# Altium project STX165R_UAVCAN_module.PrjPcb
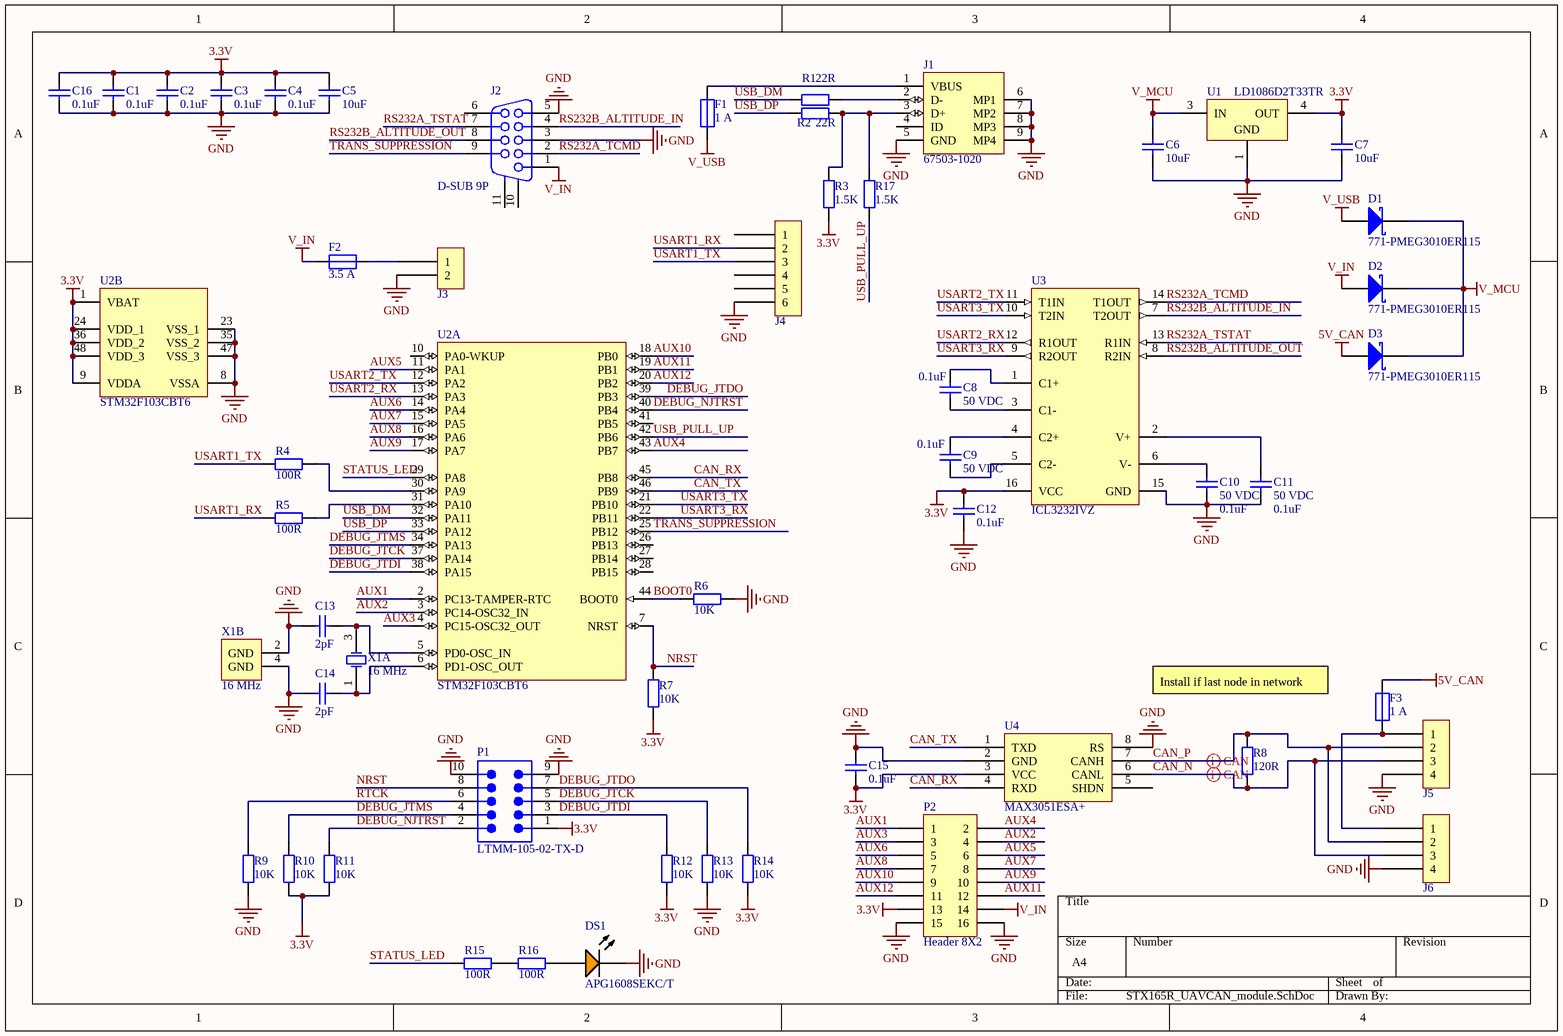
[diagram p0: STX165R_UAVCAN_module.SchDoc]
1 sheet, 53 parts. Net scope: global (net labels, ports and power ports of the same name join across sheets).
Board file: PCB_main.PcbDoc

## Sheet STX165R_UAVCAN_module.SchDoc
size A4

### Parts
C1  value 0.1uF  [0603C_L]  (hidden comment: VJ0603Y104JXJPW1BC)
C2  value 0.1uF  [0603C_L]  (hidden comment: VJ0603Y104JXJPW1BC)
C3  value 0.1uF  [0603C_L]  (hidden comment: VJ0603Y104JXJPW1BC)
C4  value 0.1uF  [0603C_L]  (hidden comment: VJ0603Y104JXJPW1BC)
C5  value 10uF  [1206_1.6_L]  (hidden comment: TMK316B7106KL-TD)
C6  value 10uF  [1206_1.6_L]  (hidden comment: GRM31CR61H106MA12L)
C7  value 10uF  [1206_1.6_L]  (hidden comment: TMK316B7106KL-TD)
C8  value 0.1uF  Voltage Rating DC: 50 VDC  [0603C_L]  (hidden comment: GRM188R71H104KA93D)
C9  value 0.1uF  Voltage Rating DC: 50 VDC  [0603C_L]  (hidden comment: GRM188R71H104KA93D)
C10  value 0.1uF  Voltage Rating DC: 50 VDC  [0603C_L]  (hidden comment: GRM188R71H104KA93D)
C11  value 0.1uF  Voltage Rating DC: 50 VDC  [0603C_L]  (hidden comment: GRM188R71H104KA93D)
C12  value 0.1uF  [0603C_L]  (hidden comment: VJ0603Y104JXJPW1BC)
C13  value 2pF  [0603C_L]  (hidden comment: C1608C0G1H020C080AA)
C14  value 2pF  [0603C_L]  (hidden comment: C1608C0G1H020C080AA)
C15  value 0.1uF  [0603C_L]  (hidden comment: VJ0603Y104JXJPW1BC)
C16  value 0.1uF  [0603C_L]  (hidden comment: VJ0603Y104JXJPW1BC)
D1  Supplier Part Number 1: 771-PMEG3010ER115  [SOD123W_L]  (hidden comment: PMEG3010ER,115)
D2  Supplier Part Number 1: 771-PMEG3010ER115  [SOD123W_L]  (hidden comment: PMEG3010ER,115)
D3  Supplier Part Number 1: 771-PMEG3010ER115  [SOD123W_L]  (hidden comment: PMEG3010ER,115)
DS1  APG1608SEKC/T  [KING-LED0603-25-ORANGE_V]
F1  Current Rating: 1 A  [0603R_0.45_L]  (hidden comment: F0603E1R00FSTR)
F2  Current Rating: 3.5 A  [0603R_0.45_L]  (hidden comment: 0603SFV350F/32-2)
F3  Current Rating: 1 A  [0603R_0.45_L]  (hidden comment: F0603E1R00FSTR)
J1  67503-1020  [MOLX-67503-1020_V]
J2  D-SUB 9P  [1-1634222-2]
J3  43650-0224  [43650-0224]  (value not drawn)
J4  BM06B-GHS-TBT(LF)(SN)(N)  [BM06B-GHS-TBT]  (value not drawn)
J5  BM04B-GHS-TBT(LF)(SN)(N)  [BM04B-GHS-TBT]  (value not drawn)
J6  BM04B-GHS-TBT(LF)(SN)(N)  [BM04B-GHS-TBT]  (value not drawn)
P1  LTMM-105-02-TX-D  [SMTC-LTMM-105-02-XX-D]
P2  Header 8X2  [HDR2X8]
R1  value 22R  [0603R_0.45_L]  (hidden comment: CRCW060322R0JNEB)
R2  value 22R  [0603R_0.45_L]  (hidden comment: CRCW060322R0JNEB)
R3  value 1.5K  [0603R_0.45_L]  (hidden comment: CRCW06031K50JNEB)
R4  value 100R  [0603R_0.45_L]  (hidden comment: CRCW0603100RJNEB)
R5  value 100R  [0603R_0.45_L]  (hidden comment: CRCW0603100RJNEB)
R6  value 10K  [0603R_0.45_L]  (hidden comment: CRCW060310K0JNEB)
R7  value 10K  [0603R_0.45_L]  (hidden comment: CRCW060310K0JNEB)
R8  value 120R  [0603R_0.45_L]  (hidden comment: CRCW0603120RJNEB)
R9  value 10K  [0603R_0.45_L]  (hidden comment: CRCW060310K0JNEB)
R10  value 10K  [0603R_0.45_L]  (hidden comment: CRCW060310K0JNEB)
R11  value 10K  [0603R_0.45_L]  (hidden comment: CRCW060310K0JNEB)
R12  value 10K  [0603R_0.45_L]  (hidden comment: CRCW060310K0JNEB)
R13  value 10K  [0603R_0.45_L]  (hidden comment: CRCW060310K0JNEB)
R14  value 10K  [0603R_0.45_L]  (hidden comment: CRCW060310K0JNEB)
R15  value 100R  [0603R_0.45_L]  (hidden comment: CRCW0603100RJNEB)
R16  value 100R  [0603R_0.45_L]  (hidden comment: CRCW0603100RJNEB)
R17  value 1.5K  [0603R_0.45_L]  (hidden comment: CRCW06031K50JNEB)
U1  LD1086D2T33TR  [TO-263_N]
U2  STM32F103CBT6  [STM-LQFP48_L]  (parts A,B of 2)
U3  ICL3232IVZ  [TSSOP16_L]
U4  MAX3051ESA+  [SOIC8_L]
X1  Frequency: 16 MHz  [TSX-3225 16.0000MF09Z-AC3]  (hidden comment: CRYS 16MHz 9pF)  (parts A,B of 2)

### Nets
3.3V: C1.2 C2.2 C3.2 C4.2 C5.2 C7.2 C12.2 C15.1 C16.2 P1.1 P2.13 R3.1 R7.1 R10.1 R11.1 R12.1 R14.1 U1.4(OUT) U2.1(VBAT) U2.9(VDDA) U2.24(VDD_1) U2.36(VDD_2) U2.48(VDD_3) U3.16(VCC) U4.3(VCC)
5V_CAN: D3.2(A) F3.2
GND: C1.1 C2.1 C3.1 C4.1 C5.1 C6.1 C7.1 C10.1 C11.1 C12.1 C13.1 C14.1 C15.2 C16.1 DS1.2(K) J1.5(GND) J1.6(MP1) J1.7(MP2) J1.8(MP3) J1.9(MP4) J2.3 J2.5 J3.2 J4.6 J5.4 J6.4 P1.9 P1.10 P2.15 P2.16 R6.1 R9.1 R13.1 U1.1(GND) U2.8(VSSA) U2.23(VSS_1) U2.35(VSS_2) U2.47(VSS_3) U3.15(GND) U4.2(GND) U4.8(RS) X1.2(GND) X1.4(GND)
V_IN: D2.2(A) F2.1 J2.1 P2.14
V_MCU: C6.2 D1.1(K) D2.1(K) D3.1(K) U1.3(IN)
V_USB: D1.2(A) F1.1
AUX1: P2.1 U2.2(PC13-TAMPER-RTC)
AUX2: P2.4 U2.3(PC14-OSC32_IN)
AUX3: P2.3 U2.4(PC15-OSC32_OUT)
AUX4: P2.2 U2.43(PB7)
AUX5: P2.6 U2.11(PA1)
AUX6: P2.5 U2.14(PA4)
AUX7: P2.8 U2.15(PA5)
AUX8: P2.7 U2.16(PA6)
AUX9: P2.10 U2.17(PA7)
AUX10: P2.9 U2.18(PB0)
AUX11: P2.12 U2.19(PB1)
AUX12: P2.11 U2.20(PB2)
BOOT0: R6.2 U2.44(BOOT0)
CAN_N: J5.3 J6.3 R8.1 U4.6(CANL)
CAN_P: J5.2 J6.2 R8.2 U4.7(CANH)
CAN_RX: U2.45(PB8) U4.4(RXD)
CAN_TX: U2.46(PB9) U4.1(TXD)
DEBUG_JTCK: P1.5 R13.2 U2.37(PA14)
DEBUG_JTDI: P1.3 R12.2 U2.38(PA15)
DEBUG_JTDO: P1.7 R14.2 U2.39(PB3)
DEBUG_JTMS: P1.4 R10.2 U2.34(PA13)
DEBUG_NJTRST: P1.2 R11.2 U2.40(PB4)
NRST: P1.8 R7.2 U2.7(NRST)
RS232A_TCMD: J2.2 U3.14(T1OUT)
RS232A_TSTAT: J2.7 U3.13(R1IN)
RS232B_ALTITUDE_IN: J2.4 U3.7(T2OUT)
RS232B_ALTITUDE_OUT: J2.8 U3.8(R2IN)
RTCK: P1.6 R9.2
STATUS_LED: R15.2 U2.29(PA8)
TRANS_SUPPRESSION: J2.9 U2.25(PB12)
USART1_RX: J4.2 R5.1
USART1_TX: J4.3 R4.1
USART2_RX: U2.13(PA3) U3.12(R1OUT)
USART2_TX: U2.12(PA2) U3.11(T1IN)
USART3_RX: U2.22(PB11) U3.9(R2OUT)
USART3_TX: U2.21(PB10) U3.10(T2IN)
USB_DM: R1.1 U2.32(PA11)
USB_DP: R2.1 U2.33(PA12)
USB_PULL_UP: R17.1 U2.42(PB6)
NetC8_1: C8.1 U3.3(C1-)
NetC8_2: C8.2 U3.1(C1+)
NetC9_1: C9.1 U3.5(C2-)
NetC9_2: C9.2 U3.4(C2+)
NetC10_2: C10.2 U3.6(V-)
NetC11_2: C11.2 U3.2(V+)
NetC13_2: C13.2 U2.5(PD0-OSC_IN) X1.3(X2)
NetC14_2: C14.2 U2.6(PD1-OSC_OUT) X1.1(X1)
NetDS1_1: DS1.1(A) R16.2
NetF1_2: F1.2 J1.1(VBUS)
NetF2_2: F2.2 J3.1
NetF3_1: F3.1 J5.1 J6.1
NetJ1_2: J1.2(D-) R1.2
NetJ1_3: J1.3(D+) R2.2 R3.2 R17.2
NetR4_2: R4.2 U2.30(PA9)
NetR5_2: R5.2 U2.31(PA10)
NetR15_1: R15.1 R16.1

Not connected (* = marked no-connect by the designer): J1 4(ID); J2 6 10(MH2) 11(MH1); J4 1 4 5; U2 10(PA0-WKUP) 26(PB13) 27(PB14) 28(PB15) 41(PB5); U4 5(SHDN)

### Layout directives
differential pair: CAN_N, CAN_P

### Notes on the sheet
- Install if last node in network

### Library data of the parts
C1-C4 C12 C15 C16 = VJ0603Y104JXJPW1BC: CAP CER 0603 0.1uF 16V X7R 5%; Manufacturer: Vishay / Vitramon; Type: Ultra Small Commodity MLCCs; Voltage Rating DC: 16 VDC; Supplier 1: Mouser; Manufacturer Part Number: VJ0603Y104JXJPW1BC; RoHS: RoHS Compliant; Category: Multilayer Ceramic Capacitors MLCC - SMD/SMT; Stock 1: 30210; Pricing 1: 1=0.091, 50=0.022, 100=0.017, 500=0.015, 1000=0.014, 15000=0.011, 75000=0.010 (EUR); Height: 0.95 mm; Length: 1.6 mm; Package/Case: 0603 (1608 metric); Packaging: Reel; Product: General Type MLCCs; Series: VJ W1BC; Termination Style: SMD/SMT; Tolerance: 5 %; Voltage Rating AC: -; Width: 0.8 mm; Brand: Vishay / Vitramon; Case Code - in: 0603; Case Code - mm: 1608; Dielectric: X7R; Maximum Operating Temperature: + 125 C; Minimum Operating Temperature: - 55 C; Standard Pack Qty: 15000; RoHS - Mouser: Y; Minimum Order Quantity: 1; Reeling: True; ComponentLink1URL: http://www.mouser.com/ds/2/427/vjw1bcbascomseries-223529.pdf; ComponentLink1Description: http://www.mouser.com/ds/2/427/vjw1bcbascomseries-223529.pdf; Supplier Part Number 1: 77-VJ0603Y104JXJPBC; Capacitance: 0.1 uF
C5 C7 = TMK316B7106KL-TD: CAP CER 1206 10uF 25V X7R 10%; Manufacturer: Taiyo Yuden; Type: Multilayer Ceramic Capacitor; Voltage Rating DC: 25 VDC; Qualification: AEC-Q200; Supplier 1: Mouser; Supplier Part Number 1: 963-TMK316B7106KL-TD; Manufacturer Part Number: TMK316B7106KL-TD; RoHS: RoHS Compliant; Category: Multilayer Ceramic Capacitors MLCC - SMD/SMT; Stock 1: 113143; Pricing 1: 1=0.434, 10=0.230, 100=0.135, 500=0.105, 1000=0.082, 2000=0.063, 4000=0.059, 10000=0.055, 24000=0.052 (EUR); Capacitance: 10 uF; Height: 1.6 mm; Length: 3.2 mm; Package/Case: 1206 (3216 metric); Packaging: Reel; Product: General Type MLCCs; Series: M; Termination Style: SMD/SMT; Tolerance: 10 %; Width: 1.6 mm; Brand: Taiyo Yuden; Case Code - in: 1206; Case Code - mm: 3216; Dielectric: X7R; Maximum Operating Temperature: + 125 C; Minimum Operating Temperature: - 55 C; Standard Pack Qty: 2000; RoHS - Mouser: Y; Minimum Order Quantity: 1; Reeling: True; ComponentLink1URL: http://www.mouser.com/ds/2/396/mlcc_all_e-541559.pdf; ComponentLink1Description: http://www.mouser.com/ds/2/396/mlcc_all_e-541559.pdf
C6 = GRM31CR61H106MA12L: CAP CER 1206 10uF 50V X5R 20%; Manufacturer: Murata Electronics; Type: General Purpose Ceramic Capacitors; Voltage Rating DC: 50 VDC; Class: Class 2; Product Status: New Product; Supplier 1: Mouser; Supplier Part Number 1: 81-GRM31CR61H106MA2L; Manufacturer Part Number: GRM31CR61H106MA12L; RoHS: RoHS Compliant; Category: Multilayer Ceramic Capacitors MLCC - SMD/SMT; Stock 1: 0; Pricing 1: 1=0.308, 10=0.168, 100=0.110, 500=0.100, 1000=0.091, 2000=0.063, 10000=0.062, 24000=0.060, 50000=0.053 (EUR); Capacitance: 10 uF; Height: 1.6 mm; Length: 3.2 mm; Package/Case: 1206 (3216 metric); Packaging: Reel; Product: General Type MLCCs; Series: GRM; Termination Style: SMD/SMT; Tolerance: 20 %; Width: 1.6 mm; Brand: Murata Electronics; Case Code - in: 1206; Case Code - mm: 3216; Dielectric: X5R; Maximum Operating Temperature: + 85 C; Minimum Operating Temperature: - 55 C; Standard Pack Qty: 2000; RoHS - Mouser: Y; Minimum Order Quantity: 1; Reeling: True; ComponentLink1URL: http://www.mouser.com/ds/2/281/c02e-2905.pdf; ComponentLink1Description: http://www.mouser.com/ds/2/281/c02e-2905.pdf
C8-C11 = GRM188R71H104KA93D: CAP CER 0603 0.1uF 50V X7R 10%; Manufacturer: Murata Electronics; Type: General Purpose MLCC; Qualification: Commercial; Supplier 1: Mouser; Supplier Part Number 1: 81-GRM39X104K50D; Manufacturer Part Number: GRM188R71H104KA93D; RoHS: RoHS Compliant; Category: Multilayer Ceramic Capacitors MLCC - SMD/SMT; Stock 1: 1630978; Pricing 1: 1=0.091, 10=0.019, 100=0.013, 500=0.011, 1000=0.008, 4000=0.008 (EUR); Capacitance: 0.1 uF; Height: 0.8 mm; Length: 1.6 mm; Package/Case: 0603 (1608 metric); Packaging: Reel; Product: General Type MLCCs; Series: GRM; Termination Style: SMD/SMT; Tolerance: 10 %; Width: 0.8 mm; Brand: Murata Electronics; Case Code - in: 0603; Case Code - mm: 1608; Dielectric: X7R; Maximum Operating Temperature: + 125 C; Minimum Operating Temperature: - 55 C; Standard Pack Qty: 4000; RoHS - Mouser: Y; Minimum Order Quantity: 1; Reeling: True; ComponentLink1URL: http://www.mouser.com/ds/2/281/c02e-2905.pdf; ComponentLink1Description: http://www.mouser.com/ds/2/281/c02e-2905.pdf
C13 C14 = C1608C0G1H020C080AA: CAP CER 2pF 0603 50V C0G 12.5%; Manufacturer: TDK; Tolerance: 0.25 pF; Type: Commercial Grade MLCC; Voltage Rating DC: 50 VDC; Class: Class 1; Dielectric: C0G (NP0); Supplier 1: Mouser; Supplier Part Number 1: 810-C1608C0G1H020C; Manufacturer Part Number: C1608C0G1H020C080AA; RoHS: RoHS Compliant; Category: Multilayer Ceramic Capacitors MLCC - SMD/SMT; Stock 1: 11697; Pricing 1: 1=0.262, 10=0.033, 100=0.023, 500=0.020, 1000=0.015, 4000=0.013, 8000=0.011, 24000=0.010, 48000=0.008 (EUR); Capacitance: 2 pF; Height: 0.8 mm; Length: 1.6 mm; Package/Case: 0603 (1608 metric); Packaging: Reel; Product: General Type MLCCs; Series: C; Termination Style: SMD/SMT; Width: 0.8 mm; Brand: TDK; Case Code - in: 0603; Case Code - mm: 1608; Maximum Operating Temperature: + 125 C; Minimum Operating Temperature: - 55 C; Standard Pack Qty: 4000; Termination: -; RoHS - Mouser: Y; Minimum Order Quantity: 1; Reeling: True; ComponentLink1URL: http://www.mouser.com/ds/2/400/lcc_commercial_general_en-837201.pdf; ComponentLink1Description: http://www.mouser.com/ds/2/400/lcc_commercial_general_en-837201.pdf
D1-D3 = PMEG3010ER,115: Schottky Diodes & Rectifiers SCHOTTKY DIODE; Manufacturer: NXP Semiconductors; Configuration: Single; If - Forward Current: 1 A; Ifsm - Forward Surge Current: 50 A; Ir - Reverse Current: 1500 uA; Pd - Power Dissipation: 570 mW; Vf - Forward Voltage: 320 mV; Vrrm - Repetitive Reverse Voltage: 30 V; Supplier 1: Mouser; Manufacturer Part Number: PMEG3010ER,115; RoHS: RoHS Compliant; Category: Schottky Diodes & Rectifiers; Stock 1: 26531; Pricing 1: 1=0.380, 10=0.288, 100=0.161, 1000=0.117, 3000=0.100, 9000=0.094, 24000=0.086, 45000=0.083 (EUR); Length: 2.8 mm; Package / Case: SOD-123; Packaging: Reel; Product: Schottky Rectifiers; Technology: Si; Termination Style: SMD/SMT; Type: Schottky Diode; Width: 1.9 mm; Brand: NXP Semiconductors; Mounting Style: SMD/SMT; Maximum Operating Temperature: + 150 C; Minimum Operating Temperature: - 55 C; Standard Pack Qty: 3000; RoHS - Mouser: Y; Minimum Order Quantity: 1; Reeling: True; ComponentLink1URL: http://www.mouser.com/ds/2/302/PMEG3010ER-842338.pdf; ComponentLink1Description: http://www.mouser.com/ds/2/302/PMEG3010ER-842338.pdf
DS1 = CMP-0239-00002-1: LED, SMT, 0603(1608), 0.25mm Tthickness, Super Bright Orange; Forward Current: 30 mA; Power Dissipation: 75 mW; Reverse Voltage: 5 V; Packing: Reel; PackageDescription: 2-Pin SMT LED, 1.6 x 0.8 mm Body, 0.25mm Thickness; ComponentLink1URL: http://www.kingbrightusa.com/; PackageVersion: Rev. 4A, 12/2011; Storage Temperature: -40 to 85 degC; PartNumber: APG1608SEKC/T; Mounting Technology: Surface Mount; ComponentLink2Description: Datasheet; DatasheetVersion: Rev. 4A, 12/2011; ComponentLink2URL: http://www.kingbrightusa.com/images/catalog/SPEC/APG1608SEKC-T.pdf; PackageReference: LED0603-25-ORANGE; ComponentLink1Description: Manufacturer URL
F1 F3 = F0603E1R00FSTR: FUSE 0603 1.0A FAST; Manufacturer: AVX; Resistance: 0.13 Ohms; Voltage Rating DC: 32 VDC; Fuse Size / Group: 0603 (1608 metric); Fuse Type: Fast Blow; Interrupt Rating: 50 Amps; Supplier 1: Mouser; Manufacturer Part Number: F0603E1R00FSTR; RoHS: RoHS Compliant; Category: Surface Mount Fuses; Stock 1: 6505; Pricing 1: 1=0.256, 50=0.251, 100=0.208, 500=0.173, 1000=0.165, 3000=0.132, 6000=0.128, 9000=0.125 (EUR); Height: 0.63 mm; Length: 1.6 mm; Operating Temperature Range: - 55 C to + 125 C; Packaging: Reel; Product: Surface Mount Fuse; Series: F0603E; Width: 0.81 mm; Brand: AVX; Standard Pack Qty: 3000; Tradename: Accu-Guard II; RoHS - Mouser: Y; Minimum Order Quantity: 1; Reeling: True; ComponentLink1URL: http://www.mouser.com/ds/2/40/accug2-25369.pdf; ComponentLink1Description: http://www.mouser.com/ds/2/40/accug2-25369.pdf; Supplier Part Number 1: 581-F0603E1R00FSTR
F2 = 0603SFV350F/32-2: FUSE 0603 3.5A FAST; Manufacturer: TE Connectivity / Raychem; Voltage Rating DC: 32 VDC; Fuse Size / Group: 0603 (1608 metric); Fuse Type: Fast Blow; Interrupt Rating: 35 Amps; Supplier 1: Mouser; Manufacturer Part Number: 0603SFV350F/32-2; RoHS: RoHS Compliant; Category: Surface Mount Fuses; Stock 1: 16912; Pricing 1: 1=0.824, 10=0.621, 100=0.518, 250=0.505, 500=0.427, 1000=0.376, 2500=0.349, 6000=0.337, 12000=0.332 (EUR); Height: 0.51 mm; Length: 1.75 mm; Operating Temperature Range: - 55 C to + 125 C; Packaging: Reel; Product: Surface Mount Fuse; Series: SFV; Width: 0.48 mm; Brand: TE Connectivity / Raychem; Standard Pack Qty: 6000; RoHS - Mouser: Y; Minimum Order Quantity: 1; Reeling: True; ComponentLink1URL: http://www.mouser.com/ds/2/418/NG_CS_CLP00009_A_CLP00009-735180.pdf; ComponentLink1Description: http://www.mouser.com/ds/2/418/NG_CS_CLP00009_A_CLP00009-735180.pdf; Supplier Part Number 1: 650-0603SFV350F/32-2
J1 = CMP-0411-00002-1: USB, MINI, SMD, RA KME04-USBMU03A01; Manufacturer: Molex; ComponentLink1URL: http://www.molex.com/; PartNumber: 67503-1020; Mounting Technology: Surface Mount; ComponentLink1Description: Manufacturer URL; Terminal Pitch: 0.8 mm; DatasheetVersion: Rev F, 06/2009; ComponentLink2Description: Datasheet; PackageDescription: Mini USB Connector, SMT, Righer Angle; ComponentLink2URL: http://www.molex.com/pdm_docs/sd/675031020_sd.pdf; PackageReference: 67503-1020
J2 = D-SUB-9P: Receptacle Header Assemby; Supplier 1: Mouser; Supplier Part Number 1: 571-1-1634222-2
J3 = 43650-0224: Headers & Wire Housings MICRO-FIT 3.0 HEADER; Manufacturer: Molex; Current Rating: 5 A; Mounting Angle: Vertical; Number of Positions: 2 Position; Voltage Rating: 600 V; Pitch: 3 mm; Qualification: Commercial; Supplier 1: Mouser; Supplier Part Number 1: 538-43650-0224; Manufacturer Part Number: 43650-0224; RoHS: RoHS Compliant; Category: Headers & Wire Housings; Stock 1: 1526; Pricing 1: 1=1.88, 10=1.69, 25=1.61, 100=1.46, 250=1.35, 500=1.15, 1000=1.07, 1800=1.02, 3600=0.999 (EUR); Accessory Type: -; Contact Plating: Tin; Contact Type: -; Housing Material: Liquid Crystal Polymer (LCP); Number of Rows: 1 Row; Packaging: Reel; Product: Headers; Series: 43650; Termination Style: SMD; Type: Power; Brand: Molex; Contact Material: Brass; Mounting Style: SMD; Row Spacing: -; Contact Gender: Pin (Male); Standard Pack Qty: 1800; Tradename: Micro-Fit 3.0; RoHS - Mouser: Y; Minimum Order Quantity: 1; Reeling: True; ComponentLink1URL: http://www.mouser.com/ds/2/276/0436500224_PCB_HEADERS-168469.pdf; ComponentLink1Description: http://www.mouser.com/ds/2/276/0436500224_PCB_HEADERS-168469.pdf
J4 = BM06B-GHS-TBT(LF)(SN)(N): CONN HEADER GH TOP 6POS 1.25MM; Manufacturer: JST Sales America Inc.; Connector Type: Header, Shrouded; Number of Positions: 6; Number of Positions Loaded: All; Pitch: 0.049" (1.25mm); Supplier 1: Digi-Key; Supplier Part Number 1: 455-1582-1-ND; Manufacturer Part Number: BM06B-GHS-TBT(LF)(SN)(N); RoHS: RoHS Compliant; Category: Connectors, Interconnects; Stock 1: 150348; Pricing 1: 1=0.56, 10=0.524, 100=0.4019, 500=0.34948, 1000=0.28832 (USD); Packaging: Cut Tape (CT); Contact Type: Outer Shroud Contact; Number of Rows: 1; Row Spacing: -; Contact Mating Length: -; Mounting Type: Surface Mount; Termination: Solder; Fastening Type: Locking Ramp; Features: Solder Retention; Contact Finish: Tin; Contact Finish Thickness: -; Color: Natural; ComponentLink1URL: http://www.jst-mfg.com/product/pdf/eng/eGH.pdf; ComponentLink1Description: http://www.jst-mfg.com/product/pdf/eng/eGH.pdf
J5 J6 = BM04B-GHS-TBT(LF)(SN)(N): CONN HEADER GH TOP 4POS 1.25MM; Manufacturer: JST Sales America Inc.; Connector Type: Header, Shrouded; Number of Positions: 4; Number of Positions Loaded: All; Pitch: 0.049" (1.25mm); Supplier 1: Digi-Key; Supplier Part Number 1: 455-1580-1-ND; Manufacturer Part Number: BM04B-GHS-TBT(LF)(SN)(N); RoHS: RoHS Compliant; Category: Connectors, Interconnects; Stock 1: 26095; Pricing 1: 1=0.44, 10=0.413, 100=0.3163, 500=0.27502, 1000=0.22689 (USD); Packaging: Cut Tape (CT); Contact Type: Outer Shroud Contact; Number of Rows: 1; Row Spacing: -; Contact Mating Length: -; Mounting Type: Surface Mount; Termination: Solder; Fastening Type: Locking Ramp; Features: Solder Retention; Contact Finish: Tin; Contact Finish Thickness: -; Color: Natural; ComponentLink1URL: http://www.jst-mfg.com/product/pdf/eng/eGH.pdf; ComponentLink1Description: http://www.jst-mfg.com/product/pdf/eng/eGH.pdf
P1 = CMP-1028-00010-1: Shrouded Header & Stacker, Through-Hole, Vertical, -55 to 105 degC, 2 mm Pitch, 10-Pin, Male, RoHS; Manufacturer: Samtec; Pitch: 2 mm; RoHS: True; Temperature Range: -55 to 105 degC; PackageVersion: AQ, 5/1992; DatasheetVersion: F-214; ComponentLink1Description: Manufacturer URL; ComponentLink2Description: Datasheet; ComponentLink3Description: Package Specification; Mounting Technology: Through-hole; Orientation: Vertical; ComponentLink3URL: http://www.samtec.com/documents/webfiles/cpdf/LTMM-1XX-XX-XX-D-XX-XX-MKT.pdf; PackageReference: LTMM-105-02-XX-D; PackageDescription: LTMM Assembly; ComponentLink2URL: http://d2a072wq521u33.cloudfront.net/catalog_english//LTMM.PDF; PartNumber: LTMM-105-02-TX-D; ComponentLink1URL: http://www.samtec.com
P2 = Header 8X2: Header, 8-Pin, Dual row; LatestRevisionDate: 17-Jul-2002; LatestRevisionNote: Re-released for DXP Platform.; Publisher: Altium Limited
R1 R2 = CRCW060322R0JNEB: RES 0603 22R 5% 100mW; Manufacturer: Vishay / Dale; Resistance: 22 Ohms; Temperature Coefficient: 200 PPM / K; Voltage Rating: 75 V; Qualification: Commercial; Supplier 1: Mouser; Supplier Part Number 1: 71-CRCW060322R0JNEB; Manufacturer Part Number: CRCW060322R0JNEB; RoHS: RoHS Compliant By Exemption; Category: Thick Film Resistors - SMD; Stock 1: 41125; Pricing 1: 1=0.091, 10=0.011, 100=0.008, 10000=0.004, 30000=0.002 (EUR); Height: 0.45 mm; Length: 1.55 mm; Operating Temperature Range: - 55 C to + 155 C; Package/Case: 0603 (1608 metric); Packaging: Reel; Power Rating: 100 mW; Product: Thick Film Resistors SMD; Series: CRCW; Termination Style: SMD/SMT; Tolerance: 5 %; Width: 0.85 mm; Brand: Vishay / Dale; Case Code - in: 0603; Case Code - mm: 1608; Standard Pack Qty: 10000; RoHS - Mouser: E; Minimum Order Quantity: 1; Reeling: True; ComponentLink1URL: http://www.mouser.com/ds/2/427/dcrcwe3-109170.pdf; ComponentLink1Description: http://www.mouser.com/ds/2/427/dcrcwe3-109170.pdf
R3 R17 = CRCW06031K50JNEB: RES 0603 1.5K 5% 100mW; Manufacturer: Vishay / Dale; Resistance: 1.5 kOhms; Temperature Coefficient: 200 PPM / K; Voltage Rating: 75 V; Qualification: Commercial; Supplier 1: Mouser; Supplier Part Number 1: 71-CRCW06031K50JNEB; Manufacturer Part Number: CRCW06031K50JNEB; RoHS: RoHS Compliant By Exemption; Category: Thick Film Resistors - SMD; Stock 1: 35392; Pricing 1: 1=0.091, 10=0.009, 100=0.007, 10000=0.003, 30000=0.002 (EUR); Height: 0.45 mm; Length: 1.55 mm; Operating Temperature Range: - 55 C to + 155 C; Package/Case: 0603 (1608 metric); Packaging: Reel; Power Rating: 100 mW; Product: Thick Film Resistors SMD; Series: CRCW; Termination Style: SMD/SMT; Tolerance: 5 %; Width: 0.85 mm; Brand: Vishay / Dale; Case Code - in: 0603; Case Code - mm: 1608; Standard Pack Qty: 10000; RoHS - Mouser: E; Minimum Order Quantity: 1; Reeling: True; ComponentLink1URL: http://www.mouser.com/ds/2/427/dcrcwe3-109170.pdf; ComponentLink1Description: http://www.mouser.com/ds/2/427/dcrcwe3-109170.pdf
R4 R5 R15 R16 = CRCW0603100RJNEB: RES 0603 100R 5% 100mW; Manufacturer: Vishay / Dale; Resistance: 100 Ohms; Temperature Coefficient: 200 PPM / K; Voltage Rating: 75 V; Qualification: Commercial; Supplier 1: Mouser; Supplier Part Number 1: 71-CRCW0603100RJNEB; Manufacturer Part Number: CRCW0603100RJNEB; RoHS: RoHS Compliant By Exemption; Category: Thick Film Resistors - SMD; Stock 1: 27634; Pricing 1: 1=0.091, 10=0.009, 100=0.007, 1000=0.005, 10000=0.003, 30000=0.002 (EUR); Height: 0.45 mm; Length: 1.55 mm; Operating Temperature Range: - 55 C to + 155 C; Package/Case: 0603 (1608 metric); Packaging: Reel; Power Rating: 100 mW; Product: Thick Film Resistors SMD; Series: CRCW; Termination Style: SMD/SMT; Tolerance: 5 %; Width: 0.85 mm; Brand: Vishay / Dale; Case Code - in: 0603; Case Code - mm: 1608; Standard Pack Qty: 10000; RoHS - Mouser: E; Minimum Order Quantity: 1; Reeling: True; ComponentLink1URL: http://www.mouser.com/ds/2/427/dcrcwe3-109170.pdf; ComponentLink1Description: http://www.mouser.com/ds/2/427/dcrcwe3-109170.pdf
R6 R7 R9-R14 = CRCW060310K0JNEB: RES 0603 10K 5% 100mW; Manufacturer: Vishay / Dale; Resistance: 10 kOhms; Temperature Coefficient: 200 PPM / K; Voltage Rating: 75 V; Qualification: Commercial; Supplier 1: Mouser; Supplier Part Number 1: 71-CRCW060310K0JNEB; Manufacturer Part Number: CRCW060310K0JNEB; RoHS: RoHS Compliant By Exemption; Category: Thick Film Resistors - SMD; Stock 1: 23952; Pricing 1: 1=0.091, 10=0.009, 100=0.007, 10000=0.003, 30000=0.002 (EUR); Height: 0.45 mm; Length: 1.55 mm; Operating Temperature Range: - 55 C to + 155 C; Package/Case: 0603 (1608 metric); Packaging: Reel; Power Rating: 100 mW; Product: Thick Film Resistors SMD; Series: CRCW; Termination Style: SMD/SMT; Tolerance: 5 %; Width: 0.85 mm; Brand: Vishay / Dale; Case Code - in: 0603; Case Code - mm: 1608; Standard Pack Qty: 10000; RoHS - Mouser: E; Minimum Order Quantity: 1; Reeling: True; ComponentLink1URL: http://www.mouser.com/ds/2/427/dcrcwe3-109170.pdf; ComponentLink1Description: http://www.mouser.com/ds/2/427/dcrcwe3-109170.pdf
R8 = CRCW0603120RJNEB: RES 0603 120R 5% 100mW; Manufacturer: Vishay / Dale; Resistance: 120 Ohms; Temperature Coefficient: 200 PPM / K; Voltage Rating: 75 V; Qualification: Commercial; Supplier 1: Mouser; Supplier Part Number 1: 71-CRCW0603120RJNEB; Manufacturer Part Number: CRCW0603120RJNEB; RoHS: RoHS Compliant By Exemption; Category: Thick Film Resistors - SMD; Stock 1: 61795; Pricing 1: 1=0.091, 10=0.009, 100=0.007, 10000=0.003, 30000=0.002 (EUR); Height: 0.45 mm; Length: 1.55 mm; Operating Temperature Range: - 55 C to + 155 C; Package/Case: 0603 (1608 metric); Packaging: Reel; Power Rating: 100 mW; Product: Thick Film Resistors SMD; Series: CRCW; Termination Style: SMD/SMT; Tolerance: 5 %; Width: 0.85 mm; Brand: Vishay / Dale; Case Code - in: 0603; Case Code - mm: 1608; Standard Pack Qty: 10000; RoHS - Mouser: E; Minimum Order Quantity: 1; Reeling: True; ComponentLink1URL: http://www.mouser.com/ds/2/427/dcrcwe3-109170.pdf; ComponentLink1Description: http://www.mouser.com/ds/2/427/dcrcwe3-109170.pdf
U1 = CMP-0244-00124-1: 1.5A, Low Drop Positive Voltage Regulator, 3.3V, 3-Pin D2PAK, Tape and Reel; DatasheetVersion: 11/07/2011; PackageReference: TO-263; ComponentLink1Description: Manufacturer URL; ComponentLink2URL: http://www.st.com/internet/com/TECHNICAL_RESOURCES/TECHNICAL_LITERATURE/DATASHEET/CD00001884.pdf; PackageDescription: 3-Pin Transistor Outline Package 2.54 mm Pitch, 15.4 mm Lead Span (D2PAK); ComponentLink2Description: Datasheet; PackageVersion: 2011; ComponentLink1URL: http://www.st.com
U2 = CMP-0237-00250-3: ARM Cortex-M3 32-bit MCU, 128 KB Flash, 20 KB Internal RAM, 37 I/Os, 48-pin LQFP, -40 to 85 degC, Tray; Supply Voltage(Vcc) min (V): 2; Operating Frequency(F) (Processor speed) (MHz): 72; A/D Converter: 2x12-bit (10 Channel); FLASH Size (Prog) (kB): 128; Internal RAM Size (kB): 20; I/Os (High Current): 37; ComponentLink2Description: Datasheet; PackageReference: LQFP48; PartNumber: STM32F103CBT6; ComponentLink1Description: Manufacturer URL; DatasheetVersion: Rev. 16; PackageVersion: Rev. 6, 06/2013; Packing: Tray; ComponentLink1URL: http://www.st.com/web/en/home.html; Mounting Technology: Surface Mount; ComponentLink3URL: http://www.st.com/st-web-ui/static/active/en/resource/technical/document/datasheet/DM00058181.pdf; PackageDescription: 48-Pin Low Profile Quad Flat Package, 7 x 7 mm Body, 0.5 mm Pitch; Core: ARM Cortex-M3; ComponentLink3Description: Package Specification; ComponentLink2URL: http://www.st.com/st-web-ui/static/active/en/resource/technical/document/datasheet/CD00161566.pdf
U3 = ICL3232IVZ: RS-232 Interface IC RS232 3V 2D/2R IND; Manufacturer: Intersil; Data Rate: 500 kb/s; Function: Transceiver; Number of Drivers: 2 Driver; Number of Receivers: 2 Receiver; Operating Supply Current: 1 mA; Operating Supply Voltage: 3.3 V, 5 V; Receiver Signal Type: Single-Ended; Supply Voltage - Max: 5.5 V; Supplier 1: Mouser; Supplier Part Number 1: 968-ICL3232IVZ; Manufacturer Part Number: ICL3232IVZ; RoHS: RoHS Compliant; Category: RS-232 Interface IC; Stock 1: 2546; Pricing 1: 1=1.42, 10=1.21, 100=0.969, 500=0.849, 1000=0.702, 2500=0.652, 5000=0.628, 10000=0.610 (EUR); Package/Case: TSSOP-16; Packaging: Tube; Product: RS-232 Transceivers; Series: ICL3232; Brand: Intersil; Mounting Style: SMD/SMT; Maximum Operating Temperature: + 85 C; Minimum Operating Temperature: - 40 C; Protocol Supported: RS-232; Standard Pack Qty: 96; Supply Voltage - Min: 3 V; RoHS - Mouser: Y; Minimum Order Quantity: 1; Reeling: False; ComponentLink1URL: http://www.mouser.com/ds/2/465/icl3221-22-23-32-41-43-555317.pdf; ComponentLink1Description: http://www.mouser.com/ds/2/465/icl3221-22-23-32-41-43-555317.pdf
U4 = MAX3051ESA+: CAN Interface IC 3.3V 1Mbps Transceiver; Manufacturer: Maxim Integrated; Operating Supply Current: 35 mA; Supply Voltage - Max: 3.465 V; Supply Voltage - Min: 3.135 V; Supplier 1: Mouser; Supplier Part Number 1: 700-MAX3051ESA; Manufacturer Part Number: MAX3051ESA+; RoHS: RoHS Compliant; Category: CAN Interface IC; Stock 1: 1199; Pricing 1: 1=1.65, 10=1.56, 25=1.46, 50=1.42 (EUR); Package/Case: SOIC-8; Packaging: Tube; Product: CAN Transceivers; Series: MAX3051; Type: CAN Transceiver; Brand: Maxim Integrated; Mounting Style: SMD/SMT; Maximum Operating Temperature: + 85 C; Minimum Operating Temperature: - 40 C; Operating Supply Voltage: 3.3 V; Standard Pack Qty: 100; RoHS - Mouser: Y; Minimum Order Quantity: 1; Reeling: False; ComponentLink1URL: http://www.mouser.com/ds/2/256/MAX3051-74908.pdf; ComponentLink1Description: http://www.mouser.com/ds/2/256/MAX3051-74908.pdf
X1 = TSX-3225 16.0000MF09Z-AC3: Crystals 16MHz 10ppm 9pF -20C +75C; Manufacturer: Epson Timing; ESR: 60 Ohms; Supplier 1: Mouser; Manufacturer Part Number: TSX-3225 16.0000MF09Z-AC3; RoHS: RoHS Compliant; Category: Crystals; Stock 1: 36861; Pricing 1: 1=0.466, 10=0.350, 100=0.311, 250=0.295, 500=0.273, 1000=0.249, 2000=0.233, 5000=0.225, 10000=0.218 (EUR); Frequency Stability: 10 PPM; Height: 0.6 mm; Length: 3.2 mm; Load Capacitance: 9 pF; Operating Temperature Range: - 20 C to + 75 C; Package / Case: 1210 (3225 metric); Packaging: Reel; Series: FA-238V/FA-238/TSX-3225; Termination Style: SMD/SMT; Tolerance: 10 PPM; Type: MHz Range Crystal Unit; Width: 2.5 mm; Brand: Epson Timing; Mounting Style: SMD/SMT; Standard Pack Qty: 1000; RoHS - Mouser: Y; Minimum Order Quantity: 1; Reeling: True; ComponentLink1URL: http://www.mouser.com/ds/2/137/1721499-465440.pdf; ComponentLink1Description: http://www.mouser.com/ds/2/137/1721499-465440.pdf; Supplier Part Number 1: 732-TX325-16F09Z-AC3

## Assembly variants
Variant of STX165R_UAVCAN_UBSOTG: not fitted R3 R18 R19